# Altium schematic sheet LED.SchDoc
size A4; SheetNumber: 4; SheetTotal: 10
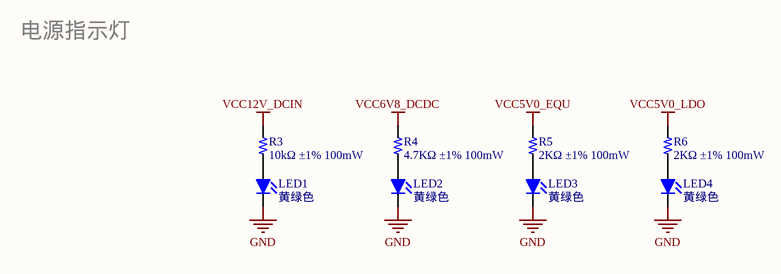
[diagram p0: LED.SchDoc]

## Parts
LED1  黄绿色  [LED-0805]
LED2  黄绿色  [LED-0805]
LED3  黄绿色  [LED-0805]
LED4  黄绿色  [LED-0805]
R3  10kΩ ±1% 100mW  [R-0603]
R4  4.7KΩ ±1% 100mW  [R-0603]
R5  2KΩ ±1% 100mW  [R-0603]
R6  2KΩ ±1% 100mW  [R-0603]

## Nets
GND: LED1.K LED2.K LED3.K LED4.K
VCC5V0_EQU: R5.2(BOT)
VCC5V0_LDO: R6.2(BOT)
VCC6V8_DCDC: R4.2(BOT)
VCC12V_DCIN: R3.2(BOT)
NetLED1_A: LED1.A R3.1(TOP)
NetLED2_A: LED2.A R4.1(TOP)
NetLED3_A: LED3.A R5.1(TOP)
NetLED4_A: LED4.A R6.1(TOP)

## Notes on the sheet
- 电源指示灯

## Library data of the parts
LED1-LED4 = LED-0805
R3-R6 = 10K_1: 国巨RC0805FR-0710K; 版本: V1.00; 名称: 贴片电阻10K±1%; 物料编号: 210001830; 详细描述: 0805,1/8W,国巨RC0805FR-0710K; 制造商: 国巨